# Altium schematic sheet NNLightSwitcher_WiFi.SchDoc
size A3
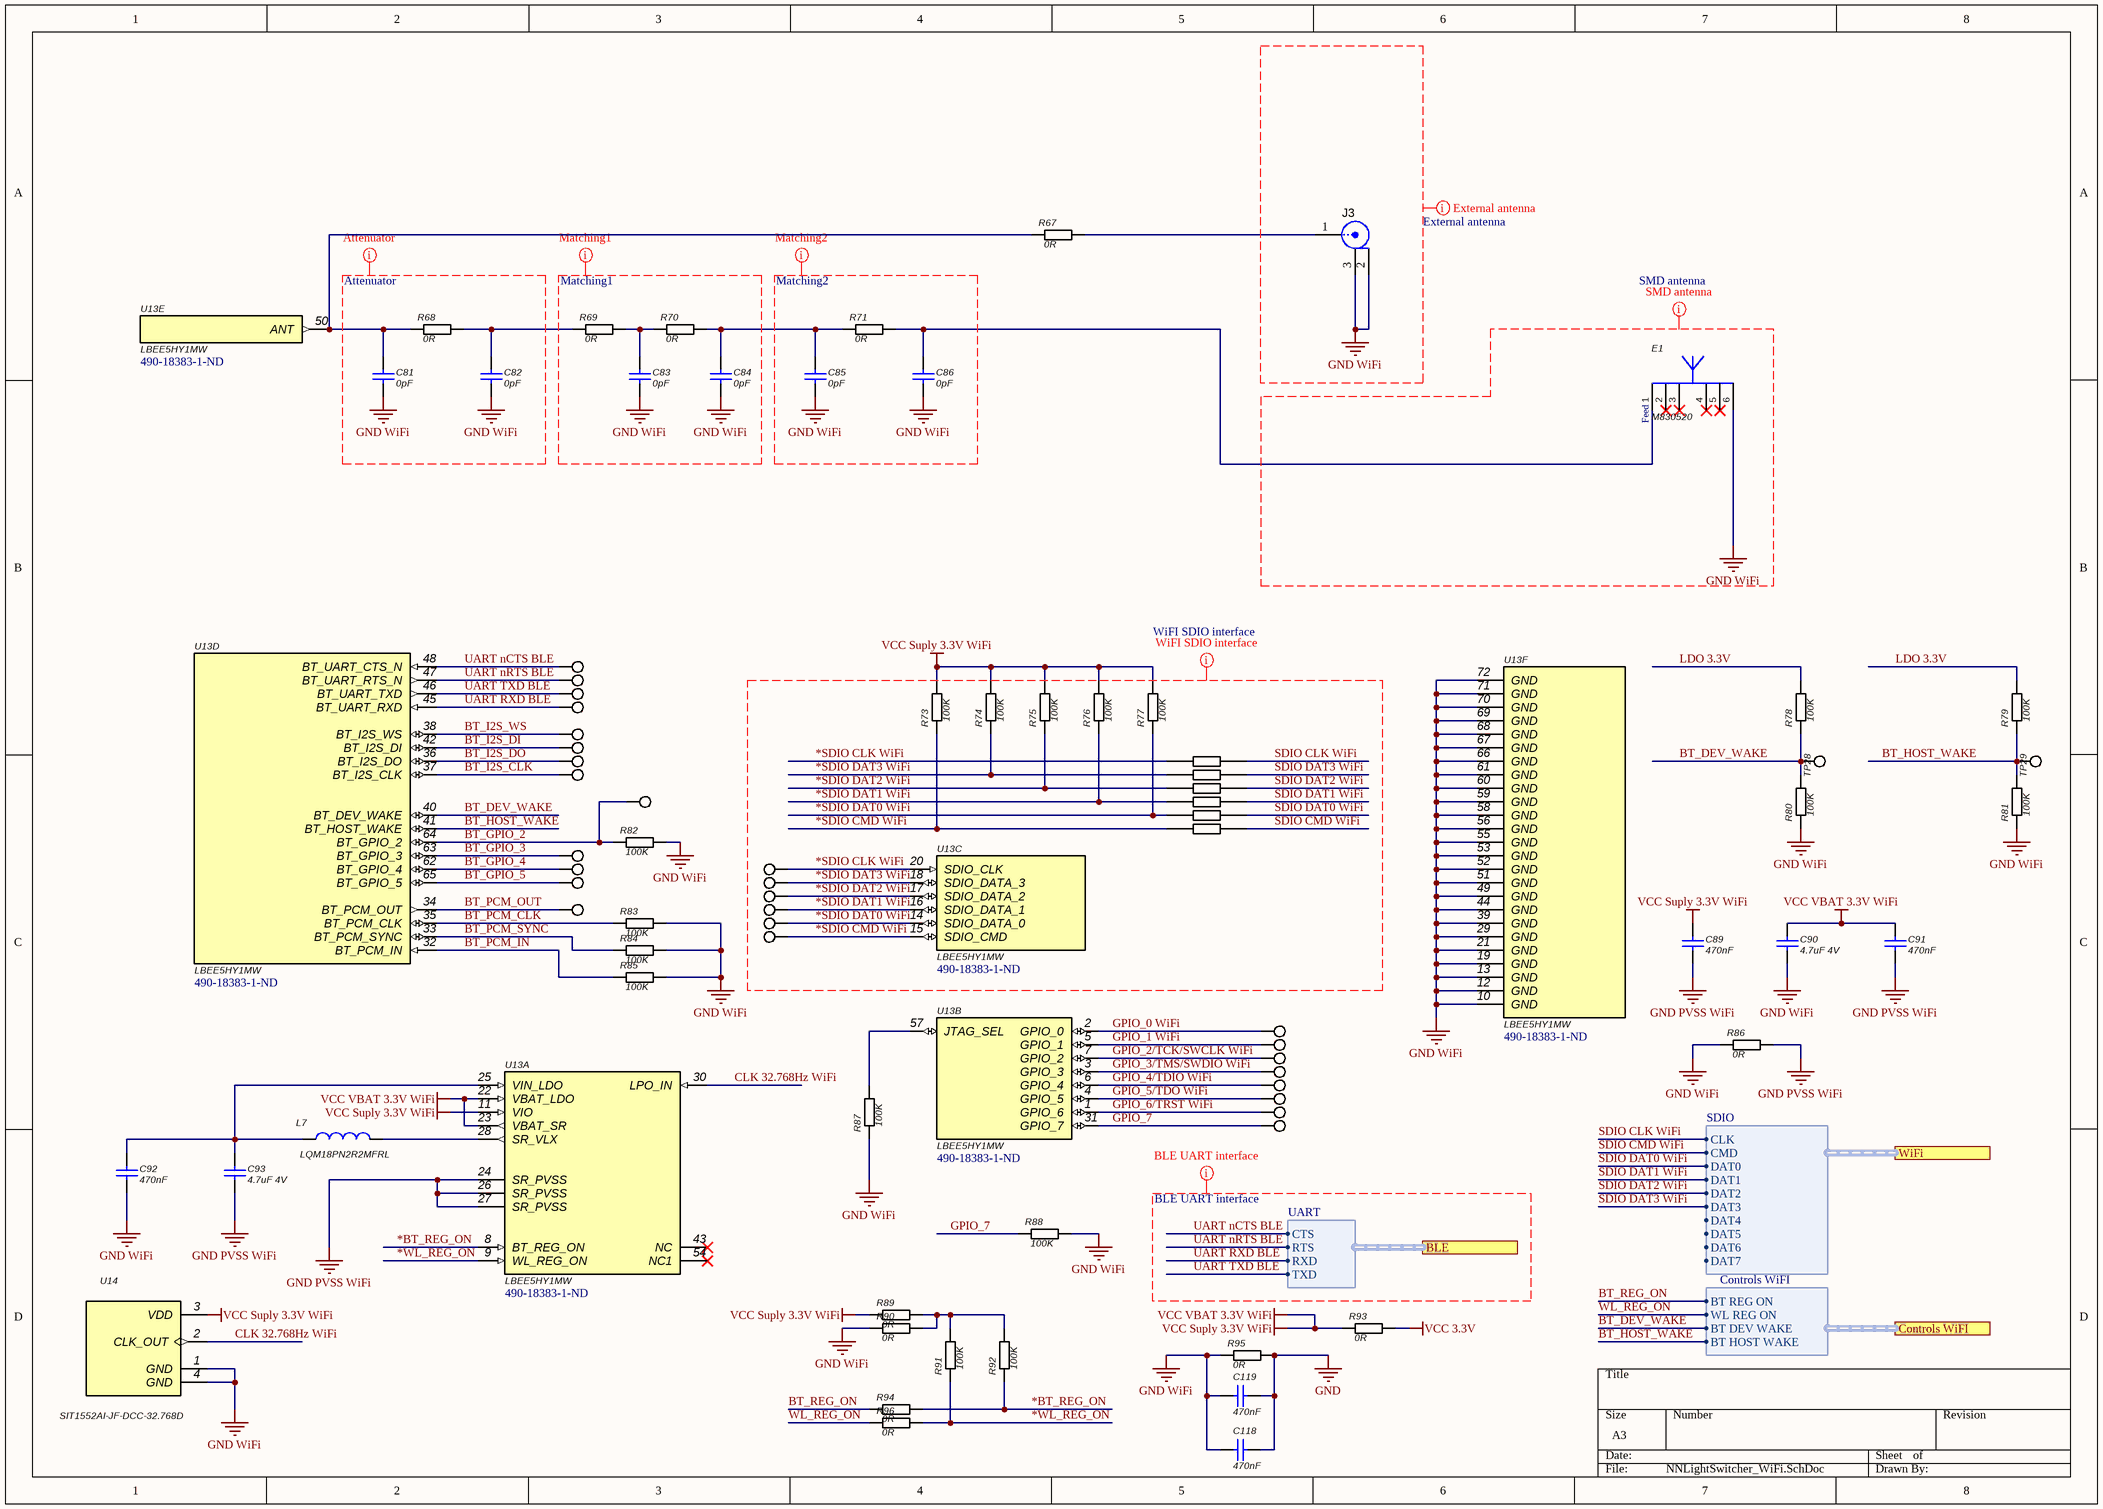
[diagram p0: NNLightSwitcher_WiFi.SchDoc]

## Parts
C81  0pF  [0402]
C82  0pF  [0402]
C83  0pF  [0402]
C84  0pF  [0402]
C85  0pF  [0402]
C86  0pF  [0402]
C89  470nF  [0402]
C90  4.7uF 4V  [0402]
C91  470nF  [0402]
C92  470nF  [0402]
C93  4.7uF 4V  [0402]
C118  470nF  [0402]
C119  470nF  [0402]
E1  M830520  [Ethertronics_M830520]
J3  U.FL-R-SMT-1(01)  [CONN_UFL-R-SMT-1]  (value not drawn)
L7  LQM18PN2R2MFRL  [*0603]
R67  0R  [0402]
R68  0R  [0402]
R69  0R  [0402]
R70  0R  [0402]
R71  0R  [0402]
R73  100K  [0402]
R74  100K  [0402]
R75  100K  [0402]
R76  100K  [0402]
R77  100K  [0402]
R78  100K  [0402]
R79  100K  [0402]
R80  100K  [0402]
R81  100K  [0402]
R82  100K  [0402]
R83  100K  [0402]
R84  100K  [0402]
R85  100K  [0402]
R86  0R  [0402]
R87  100K  [0402]
R88  100K  [0402]
R89  0R  [0402]
R90  0R  [0402]
R91  100K  [0402]
R92  100K  [0402]
R93  0R  [0402]
R94  0R  [0402]
R95  0R  [0402]
R96  0R  [0402]
RN27  EXB-2HV431JV  [*RESCAXE50P380X160X55-16N]  (value not drawn)  (parts A,B,C,D,E,F of 8)
TP21  Test point  [Testpoint_with_pad]  (value not drawn)
TP22  Test point  [Testpoint_with_pad]  (value not drawn)
TP23  Test point  [Testpoint_with_pad]  (value not drawn)
TP24  Test point  [Testpoint_with_pad]  (value not drawn)
TP25  Test point  [Testpoint_with_pad]  (value not drawn)
TP26  Test point  [Testpoint_with_pad]  (value not drawn)
TP27  Test point  [Testpoint_with_pad]  (value not drawn)
TP28  Test point  [Testpoint_with_pad]  (value not drawn)
TP29  Test point  [Testpoint_with_pad]  (value not drawn)
TP30  Test point  [Testpoint_with_pad]  (value not drawn)
TP31  Test point  [Testpoint_Keystone_Miniature]  (value not drawn)
TP32  Test point  [Testpoint_Keystone_Miniature]  (value not drawn)
TP33  Test point  [Testpoint_Keystone_Miniature]  (value not drawn)
TP34  Test point  [Testpoint_with_pad]  (value not drawn)
TP35  Test point  [Testpoint_Keystone_Miniature]  (value not drawn)
TP36  Test point  [Testpoint_with_pad]  (value not drawn)
TP37  Test point  [Testpoint_with_pad]  (value not drawn)
TP38  Test point  [Testpoint_Keystone_Miniature]  (value not drawn)
TP39  Test point  [Testpoint_with_pad]  (value not drawn)
TP40  Test point  [Testpoint_with_pad]  (value not drawn)
TP41  Test point  [Testpoint_with_pad]  (value not drawn)
TP42  Test point  [Testpoint_with_pad]  (value not drawn)
TP43  Test point  [Testpoint_with_pad]  (value not drawn)
TP44  Test point  [Testpoint_with_pad]  (value not drawn)
TP45  Test point  [Testpoint_with_pad]  (value not drawn)
TP46  Test point  [Testpoint_with_pad]  (value not drawn)
TP47  Test point  [Testpoint_with_pad]  (value not drawn)
TP48  Test point  [Testpoint_with_pad]  (value not drawn)
TP49  Test point  [Testpoint_Keystone_Miniature]  (value not drawn)
U13  LBEE5HY1MW  Supplier Part Number 1: 490-18383-1-ND  [1MW LGA]  (parts A,B,C,D,E,F of 6)
U14  SIT1552AI-JF-DCC-32.768D  [*BGA4C100X41P2X2_154X84X60N]

## Ports
BLE (harness UART), Controls WiFI (harness Controls WiFI), WiFi (harness SDIO)

## Harnesses
SDIO: CLK, CMD, DAT1, DAT0, DAT3, DAT2, DAT5, DAT4, DAT7, DAT6
Controls WiFI: BT DEV WAKE, WL REG ON, BT REG ON, BT HOST WAKE
UART: CTS, RTS, RXD, TXD

## Nets
GND: C118.2 C119.2 R95.2
GND PVSS WiFi: C89.2 C91.2 C93.2 R86.2 U13.24(SR_PVSS) U13.26(SR_PVSS) U13.27(SR_PVSS)
GND WiFi: C81.2 C82.2 C83.2 C84.2 C85.2 C86.2 C90.2 C92.2 C118.1 C119.1 E1.6 J3.2 J3.3 R80.1 R81.1 R82.2 R83.2 R84.2 R85.2 R86.1 R87.1 R88.2 R90.1 R95.1 U13.10(GND) U13.12(GND) U13.13(GND) U13.19(GND) U13.21(GND) U13.29(GND) U13.39(GND) U13.44(GND) U13.49(GND) U13.51(GND) U13.52(GND) U13.53(GND) U13.55(GND) U13.56(GND) U13.58(GND) U13.59(GND) U13.60(GND) U13.61(GND) U13.66(GND) U13.67(GND) U13.68(GND) U13.69(GND) U13.70(GND) U13.71(GND) U13.72(GND) U14.1(GND) U14.4(GND)
VCC 3.3V: R93.2
VCC Suply 3.3V WiFi: C89.1 C90.1 C91.1 R73.2 R74.2 R75.2 R76.2 R77.2 R89.1 R93.1 U13.11(VIO) U13.22(VBAT_LDO) U13.23(VBAT_SR) U14.3(VDD)  [also labelled VCC VBAT 3.3V WiFi]
*BT_REG_ON: R92.1 R94.2 U13.8(BT_REG_ON)
*SDIO CLK WiFi: RN27.1 TP34.1 U13.20(SDIO_CLK)
*SDIO CMD WiFi: R73.1 RN27.4 TP41.1 U13.15(SDIO_CMD)
*SDIO DAT0 WiFi: R77.1 RN27.2 TP40.1 U13.14(SDIO_DATA_0)
*SDIO DAT1 WiFi: R76.1 RN27.6 TP39.1 U13.16(SDIO_DATA_1)
*SDIO DAT2 WiFi: R75.1 RN27.3 TP37.1 U13.17(SDIO_DATA_2)
*SDIO DAT3 WiFi: R74.1 RN27.5 TP36.1 U13.18(SDIO_DATA_3)
*WL_REG_ON: R91.1 R96.2 U13.9(WL_REG_ON)
BT_DEV_WAKE: R78.1 R80.2 TP28.1 U13.40(BT_DEV_WAKE) ; port Controls WiFI.BT DEV WAKE
BT_GPIO_2: R82.1 TP31.1 U13.64(BT_GPIO_2)
BT_GPIO_3: TP32.1 U13.63(BT_GPIO_3)
BT_GPIO_4: TP33.1 U13.62(BT_GPIO_4)
BT_GPIO_5: TP35.1 U13.65(BT_GPIO_5)
BT_HOST_WAKE: R79.1 R81.2 TP29.1 U13.41(BT_HOST_WAKE) ; port Controls WiFI.BT HOST WAKE
BT_I2S_CLK: TP30.1 U13.37(BT_I2S_CLK)
BT_I2S_DI: TP26.1 U13.42(BT_I2S_DI)
BT_I2S_DO: TP27.1 U13.36(BT_I2S_DO)
BT_I2S_WS: TP25.1 U13.38(BT_I2S_WS)
BT_PCM_CLK: R83.1 U13.35(BT_PCM_CLK)
BT_PCM_IN: R85.1 U13.32(BT_PCM_IN)
BT_PCM_OUT: TP38.1 U13.34(BT_PCM_OUT)
BT_PCM_SYNC: R84.1 U13.33(BT_PCM_SYNC)
BT_REG_ON: R94.1 ; port Controls WiFI.BT REG ON
CLK 32.768Hz WiFi: U13.30(LPO_IN) U14.2(CLK_OUT)
GPIO_0 WiFi: TP42.1 U13.2(GPIO_0)
GPIO_1 WiFi: TP43.1 U13.5(GPIO_1)
GPIO_2/TCK/SWCLK WiFi: TP44.1 U13.7(GPIO_2)
GPIO_3/TMS/SWDIO WiFi: TP45.1 U13.3(GPIO_3)
GPIO_4/TDIO WiFi: TP46.1 U13.6(GPIO_4)
GPIO_5/TDO WiFi: TP47.1 U13.4(GPIO_5)
GPIO_6/TRST WiFi: TP48.1 U13.1(GPIO_6)
GPIO_7: R88.1 TP49.1 U13.31(GPIO_7)
LDO 3.3V: R78.2 R79.2
SDIO CLK WiFi: RN27.16 ; port WiFi.CLK
SDIO CMD WiFi: RN27.13 ; port WiFi.CMD
SDIO DAT0 WiFi: RN27.15 ; port WiFi.DAT0
SDIO DAT1 WiFi: RN27.11 ; port WiFi.DAT1
SDIO DAT2 WiFi: RN27.14 ; port WiFi.DAT2
SDIO DAT3 WiFi: RN27.12 ; port WiFi.DAT3
UART nCTS BLE: TP21.1 U13.48(BT_UART_CTS_N) ; port BLE.CTS
UART nRTS BLE: TP22.1 U13.47(BT_UART_RTS_N) ; port BLE.RTS
UART RXD BLE: TP24.1 U13.45(BT_UART_RXD) ; port BLE.RXD
UART TXD BLE: TP23.1 U13.46(BT_UART_TXD) ; port BLE.TXD
WL_REG_ON: R96.1 ; port Controls WiFI.WL REG ON
NetC81_1: C81.1 R67.1 R68.1 U13.50(ANT)
NetC82_1: C82.1 R68.2 R69.1
NetC83_1: C83.1 R69.2 R70.1
NetC84_1: C84.1 C85.1 R70.2 R71.1
NetC86_1: C86.1 E1.1(Feed) R71.2
NetC92_1: C92.1 C93.1 L7.1 U13.25(VIN_LDO)
NetJ3_1: J3.1 R67.2
NetL7_2: L7.2 U13.28(SR_VLX)
NetR87_2: R87.2 U13.57(JTAG_SEL)
NetR89_2: R89.2 R90.2 R91.2 R92.2

Not connected (* = marked no-connect by the designer): E1 2(GND)* 3(GND)* 4(Feed)* 5*; U13 43(NC)* 54(NC1)*

## Layout directives
net class Attenuator: GND WiFi
net class Matching1: GND WiFi
net class Matching2: GND WiFi
net class SMD antenna: GND WiFi
net class External antenna: GND WiFi
net class WiFI SDIO interface: *SDIO CLK WiFi, *SDIO CMD WiFi, *SDIO DAT0 WiFi, *SDIO DAT1 WiFi, *SDIO DAT2 WiFi, *SDIO DAT3 WiFi, SDIO CLK WiFi, SDIO CMD WiFi, SDIO DAT0 WiFi, SDIO DAT1 WiFi, SDIO DAT2 WiFi, SDIO DAT3 WiFi
net class BLE UART interface: UART nCTS BLE, UART nRTS BLE, UART RXD BLE, UART TXD BLE

## Notes on the sheet
- (near E1) Feed
- “Attenuator” part should be pi-network as above.
  Appropriate value of R depends on the design of the product.
  Put 0 ohm in series and no load in parallel on the initial design.
- “Matching1” part should be pi-network + 1 series component as above.
  Appropriate value of L/C/R depends on the design of the product.
  Put 0 ohm in series and no load in parallel on the initial design.
- “Matching2” part should be pi-network as above.
  Only matching1 might achieve the antenna tuning, but if you have a place
  to have this part, please add it.
  Appropriate value of L/C/R depends on the design of the product.
  Put 0 ohm in series and no load in parallel on the initial design.
- Open: SDIO interface voltage=1.8V
  10kohm PD: SDIO interface voltage=3.3V

## Library data of the parts
C81-C86 = Capacitor 0pF: ComponentLink1Description: Datasheet link; ComponentLink1URL: http://www.yageo.com/documents/recent/UPY-GP_NP0_16V-to-50V_16.pdf
C89 C91 C92 C118 C119 = Capacitor 470nF: ComponentLink1Description: Datasheet link; ComponentLink1URL: http://www.yageo.com/documents/recent/UPY-GP_NP0_16V-to-50V_16.pdf
C90 C93 = Capacitor 4.7uF 4V: ComponentLink1Description: Datasheet link; ComponentLink1URL: http://www.yageo.com/documents/recent/UPY-GP_NP0_16V-to-50V_16.pdf
E1 = 2.4-5 GHz antenna: WLAN ANTENNA 802.11, SMD; Manufacturer 1: Ethertronics; ComponentLink1Description: Datasheet URL; ComponentLink1URL: http://www.ethertronics.com/files/6014/0708/4228/Savvi_WLAN__8x3_M830510.pdf; Supplier 1: Digi-Key; Manufacturer Part Number 1: M830520; Stock 1: 10391; Pricing 1: 1=2,09000, 10=1,87400, 25=1,76800, 100=1,50630, 250=1,41440, 500=1,23760 (USD); RoHS: No; ComponentLink2URL: https://media.digikey.com/pdf/Data%20Sheets/Ethertronics/M830520.pdf?src-supplier=Digi-Key; ComponentLink2Description: https://media.digikey.com/pdf/Data%20Sheets/Ethertronics/M830520.pdf?src-supplier=Digi-Key; Supplier Part Number 1: 939-1070-1-ND
J3 = CMP-0075320-1: Receptacle, Ultra Miniature Coaxial, Male Pin, 50 ohm, SMT; Manufacturer: Hirose Electric Co. Ltd.; Alternate Manufacturer: ----; CNHeader: False; Gender: Female; ContactFinish: Gold; PartNumber: U.FL-R-SMT-1(01); PackageReference: Ultra small CO-AX SMD; CompType: Receptacle; RoHS: Y; MountType: SMT; ComponentLink1Description: Datasheet URL; ComponentLink1URL: https://www.hirose.com/product/en/download_file/key_name/U.FL%2DR%2DSMT%2D1%2801%29/category/Drawing%20(2D)/doc_file_id/37625/?file_category_id=6&item_id=03310472201&is_series=; Publisher: Texas Instruments; LatestRevisionDate: 2017-07-12; Alternate PartNumber: ----; Supplier 1: Digi-Key; Supplier Part Number 1: H122041-ND; Supplier 2: Newark; Supplier Part Number 2: 18K7517; Supplier 3: Mouser; Supplier Part Number 3: 798-U.FL-R-SMT01; Color: Beige; PinCount: 3; Orientation: Vertical; CT: False
L7 = LQM18PN2R2MFRL: Inductor Power Chip Shielded Multi-Layer 2.2uH 20% 1MHz Ferrite 750mA 375mOhm DCR 0603 T/R; Manufacturer 1: Murata; DC Resistance (DCR): 375mR; Self Resonant Frequency: 70MHz; Value: *; Case/Package: 0603; Case Code (Imperial): 0603; Case Code (Metric): 1608; ComponentLink1Description: https://datasheet.ciiva.com/29691/o05e-29691382.pdf?src-supplier=Digi-Key; ComponentLink1URL: https://datasheet.ciiva.com/29691/o05e-29691382.pdf?src-supplier=Digi-Key; Core Material: Ferrite; Current Rating: 750mA; DC Current: 750mA; Depth: 0.95mm; Height - Seated (Max): 0.037inch; Height: 0.8mm; Inductance: 2.2uH; Lead Free: Lead Free; Length: 0.063inch; Manufacturer 2: Murata; Manufacturer Part Number 1: LQM18PN2R2MFRL; Manufacturer Part Number 2: LQM18PN2R2MFRL; Max DC Current: 750mA; Max Operating Temperature: 85°C; Military Standard: Not; Min Operating Temperature: -40°C; Mount: Surface Mount; Package Quantity: 4000; Packaging: Tape and Reel; Pricing 1: 1=0,42000, 10=0,37000, 100=0,25430, 500=0,21728, 1000=0,16643 (USD); Pricing 2: 1=0,42000, 10=0,37000, 50=0,37000, 100=0,25400, 500=0,21700, 1000=0,16600, 4000=0,13700, 8000=0,12500, 10000=0,12500, 24000=0,12100, 48000=0,11500 (USD); RoHS: Yes; Shielding: Shielded; Stock 1: 15081; Stock 2: 12449; Supplier 1: Digi-Key; Supplier 2: Mouser; Supplier Part Number 1: 490-10764-1-ND; Supplier Part Number 2: 81-LQM18PN2R2MFRL; Termination: SMD/SMT; Test Frequency: 1MHz; Tolerance: 20%; Weight: 0.000141oz; Width: 0.031inch
R67-R71 R86 R89 R90 R93-R96 = Resistor 0R
R73-R85 R87 R88 R91 R92 = Resistor 100K
RN27 = EXB-2HV431JV: Res Thick Film Array; Value: 33 R
TP21-TP49 = Test point: Test Point, Miniature, SMT; ComponentLink1Description: Datasheet URL; ComponentLink1URL: http://www.keyelco.com/userAssets/store/files/5015.PDF
U13 = LBEE5HY1MW: Dual Band WiFi 11a/b/g/n/ac with Bluetooth 5.0 Module; Manufacturer 1: Murata; Manufacturer Part Number 1: LBEE5HY1MW-230; Supplier 1: Digi-Key; Stock 1: 946; Pricing 1: 1=15,66000, 10=14,16500, 25=13,04640, 100=11,92800, 250=11,18252, 500=10,43700, 1000=9,91515 (USD); RoHS: No; Manufacturer 2: Murata; Manufacturer Part Number 2: LBEE5HY1MW-230; Pricing 2: 1=15,62000, 10=14,20000, 25=13,14000, 50=13,14000, 100=12,43000, 250=10,65000, 1000=10,65000, 10000=10,65000 (USD); Stock 2: 212; Supplier 2: Mouser; Supplier Part Number 2: 81-LBEH5HY1MW-230
U14 = SIT1552AI-JF-DCC-32.768D: Ultra Small, Ultra-Low Power 32.768 kHz TCXO; Manufacturer 1: SiTime; Frequency Stability: 10ppm; Value: *; ComponentLink1Description: https://www.sitime.com/products/datasheets/sit1552/SiT1552-datasheet.pdf?src-supplier=Digi-Key; ComponentLink1URL: https://www.sitime.com/products/datasheets/sit1552/SiT1552-datasheet.pdf?src-supplier=Digi-Key; ComponentLink2Description: https://www.sitime.com/datasheet/SiT1552?src-supplier=Digi-Key; ComponentLink2URL: https://www.sitime.com/datasheet/SiT1552?src-supplier=Digi-Key; Frequency: 32.768kHz; Height: 0.024inch; Length: 0.061inch; Manufacturer 2: SiTime; Manufacturer Part Number 1: SIT1552AI-JF-DCC-32.768D; Manufacturer Part Number 2: SIT1552AI-JF-DCC-32.768D; Max Operating Temperature: 85°C; Min Operating Temperature: -40°C; Mount: Surface Mount; Packaging: Tape and Reel; Pricing 1: 1=1,98000, 10=1,88800, 50=1,84400, 100=1,58050, 500=1,53664, 1000=1,29517 (USD); Pricing 2: 1=1,85000, 10=1,74000, 50=1,74000, 100=1,49000, 250=1,42000, 500=1,26000, 1000=1,16000, 3000=1,10000, 6000=1,06000, 9000=1,02000, 10000=1,06000 (USD); RoHS: Yes; Stock 1: 12997; Stock 2: 2903; Supplier 1: Digi-Key; Supplier 2: Mouser; Supplier Part Number 1: 1473-1242-1-ND; Supplier Part Number 2: 788-1552AIJFDCC32.7D; Width: 0.033inch